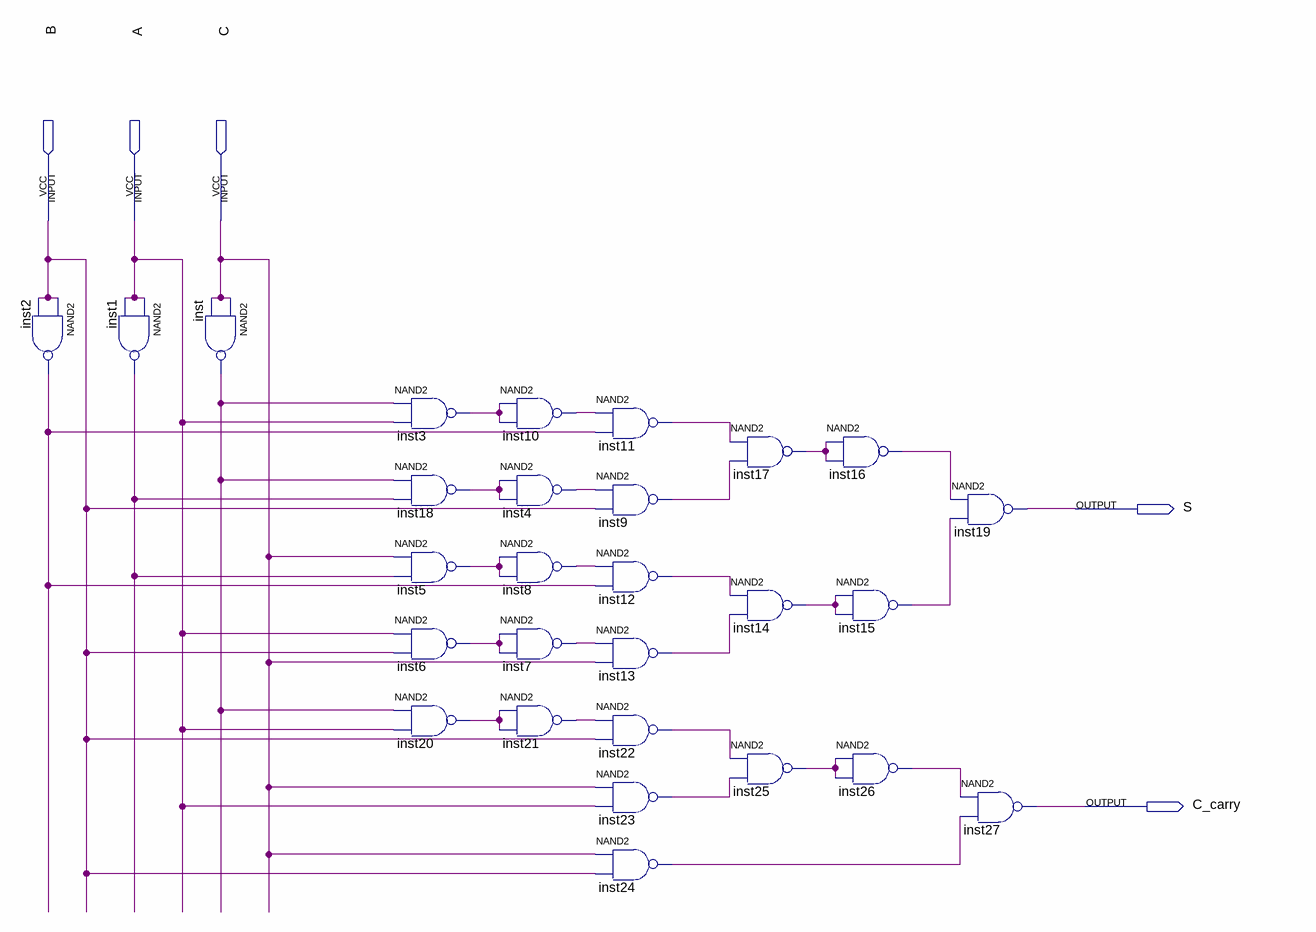
[diagram p0: schematic sheet]
// Quartus schematic CNT_2nand.bdf as structural Verilog: 28 symbols, 5 pins
module CNT_2nand (
  input  B,
  input  A,
  input  C,
  output S,
  output C_carry
);

  wire inst1_out, inst2_out, inst3_out, inst4_out, inst5_out, inst6_out, inst7_out, inst8_out, inst9_out,
       inst10_out, inst11_out, inst12_out, inst13_out, inst14_out, inst15_out, inst16_out, inst17_out,
       inst18_out, inst20_out, inst21_out, inst22_out, inst23_out, inst24_out, inst25_out, inst26_out,
       inst_out;

  nand inst2 (inst2_out, B, B);
  nand inst1 (inst1_out, A, A);
  nand inst (inst_out, C, C);
  nand inst3 (inst3_out, inst_out, A);
  nand inst18 (inst18_out, inst_out, inst1_out);
  nand inst5 (inst5_out, C, inst1_out);
  nand inst6 (inst6_out, A, B);
  nand inst20 (inst20_out, inst_out, A);
  nand inst10 (inst10_out, inst3_out, inst3_out);
  nand inst4 (inst4_out, inst18_out, inst18_out);
  nand inst8 (inst8_out, inst5_out, inst5_out);
  nand inst7 (inst7_out, inst6_out, inst6_out);
  nand inst21 (inst21_out, inst20_out, inst20_out);
  nand inst11 (inst11_out, inst10_out, inst2_out);
  nand inst9 (inst9_out, inst4_out, B);
  nand inst12 (inst12_out, inst8_out, inst2_out);
  nand inst13 (inst13_out, inst7_out, C);
  nand inst22 (inst22_out, inst21_out, B);
  nand inst23 (inst23_out, C, A);
  nand inst24 (inst24_out, C, B);
  nand inst17 (inst17_out, inst11_out, inst9_out);
  nand inst14 (inst14_out, inst12_out, inst13_out);
  nand inst25 (inst25_out, inst22_out, inst23_out);
  nand inst16 (inst16_out, inst17_out, inst17_out);
  nand inst15 (inst15_out, inst14_out, inst14_out);
  nand inst26 (inst26_out, inst25_out, inst25_out);
  nand inst19 (S, inst16_out, inst15_out);
  nand inst27 (C_carry, inst26_out, inst24_out);
endmodule
